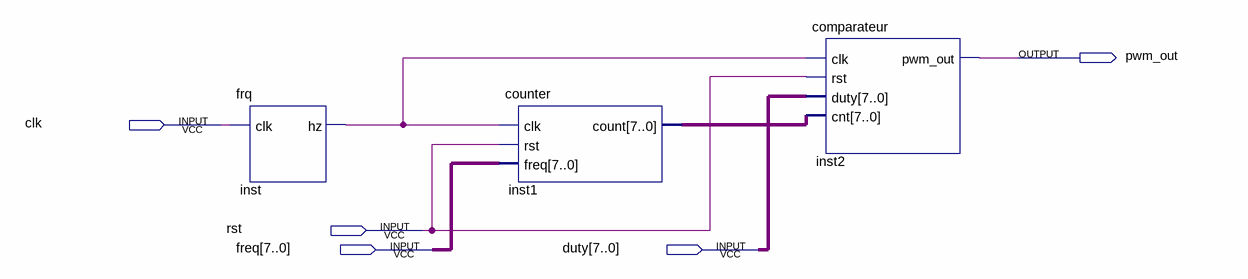
[diagram p0: schematic sheet]
// Quartus schematic PWM2.bdf as structural Verilog: 3 symbols, 5 pins
module PWM2 (
  input  clk,
  input  rst,
  input  [7:0] freq,
  input  [7:0] duty,
  output pwm_out
);

  wire inst_hz;
  wire [7:0] inst1_count;

  frq inst (.clk(clk), .hz(inst_hz));
  counter inst1 (.clk(inst_hz), .rst(rst), .freq(freq), .count(inst1_count));
  comparateur inst2 (.clk(inst_hz), .rst(rst), .duty(duty), .cnt(inst1_count), .pwm_out(pwm_out));
endmodule
